# EAGLE schematic ac and dc measurement-old (EAGLE 5.11)
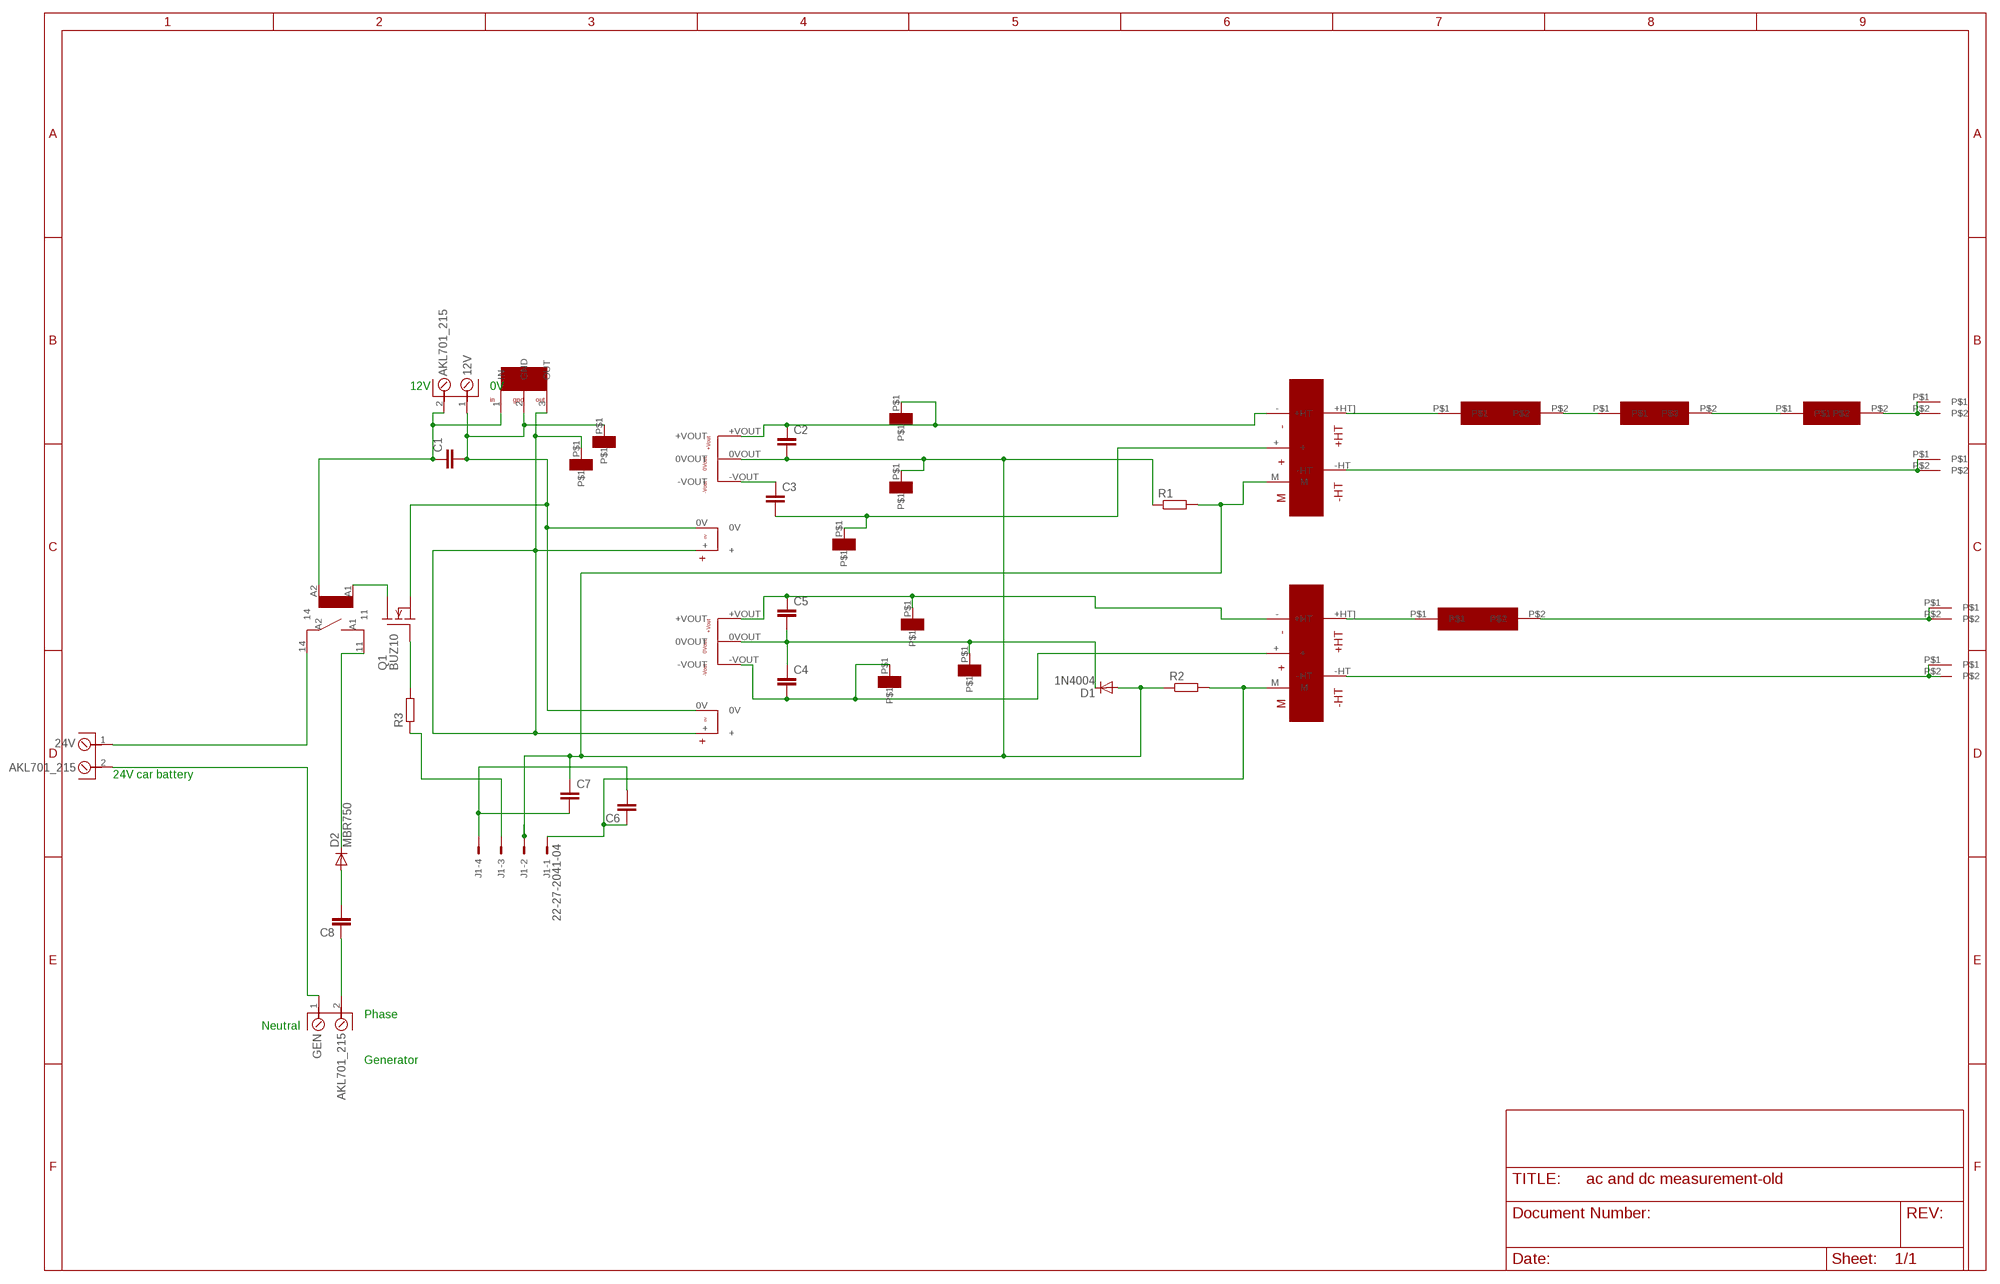
[diagram p0: schematic, sheet 1]

## Parts
5V  KFP_VOL_REG  [TO220]
12V  AKL701_215  [AKL701_2_15]
24V  AKL701_215  [AKL701_2_15]
C1  C-EU025-024X044  [C025-024X044]
C2  C-EU025-024X044  [C025-024X044]
C3  C-EU025-024X044  [C025-024X044]
C4  C-EU025-024X044  [C025-024X044]
C5  C-EU025-024X044  [C025-024X044]
C6  C-EU025-024X044  [C025-024X044]
C7  C-EU025-024X044  [C025-024X044]
C8  C-EU025-030X050  [C025-030X050]
D1  1N4004  [DO41-10]
D2  MBR750  [TO220AC]
GEN  AKL701_215  [AKL701_2_15]
J1  22-27-2041-04  [6410-04]
Q1  BUZ10  [TO220]
R1  R-EU_0204/7  [0204/7]
R2  R-EU_0204/7  [0204/7]
R3  R-EU_0204/7  [0204/7]
U$1  KFP_DC_DC  [KFP_DC-DC]
U$2  KFP_DC_DC  [KFP_DC-DC]
U$3  KFP_VOLTAGETRANSDUCER  [KFP_VOLTAGETRANSDUCER]
U$4  KFP_VOLTAGETRANSDUCER  [KFP_VOLTAGETRANSDUCER]
U$5  KFP_33K  [KFP_33K]
U$6  KFP_33K  [KFP_33K]
U$7  KFP_22K  [KFP_22K]
U$8  KFP_4.7K  [KFP_18K]
U$9  HIGH_AMP_TERMINAL  [HIGH_AMP_TERMINAL]
U$10  KFP_RELAY  [KFP_RELAYSPST]
U$11  HIGH_AMP_TERMINAL  [HIGH_AMP_TERMINAL]
U$12  HIGH_AMP_TERMINAL  [HIGH_AMP_TERMINAL]
U$13  HIGH_AMP_TERMINAL  [HIGH_AMP_TERMINAL]
U$14  KFP_TEST  [KFP_TEST]
U$15  KFP_TEST  [KFP_TEST]
U$16  KFP_TEST  [KFP_TEST]
U$17  KFP_TEST  [KFP_TEST]
U$18  KFP_TEST  [KFP_TEST]
U$19  KFP_TEST  [KFP_TEST]
U$20  KFP_TEST  [KFP_TEST]
U$21  KFP_TEST  [KFP_TEST]

## Nets
N$1: 5V.2(GND) 12V.1 C1.2 Q1.3(S) U$1.0V U$2.0V U$21.P$1
N$2: 5V.3(OUT) U$1.+ U$2.+ U$16.P$1
N$3: C3.2 U$3.+ U$14.P$1
N$4: C4.2 U$2.-VOUT U$4.+ U$18.P$1
N$5: C6.2 C7.2 J1.4
N$6: C2.1 U$1.+VOUT U$3.- U$15.P$1
N$7: C4.1 C5.2 D1.C U$2.0VOUT U$20.P$1
N$8: C5.1 U$2.+VOUT U$4.- U$17.P$1
N$9: 24V.2 GEN.1
N$10 [AC]: U$4.+HT](+HT) U$5.P$1
N$11: C6.1 J1.1 R2.2 U$4.M
N$12 [DC LINK]: U$3.+HT](+HT) U$6.P$1
N$13 [DC LINK]: U$6.P$2 U$7.P$1
N$14: Q1.2(D) U$10.A1
N$15 [AC]: U$5.P$2 U$12.P$1 U$12.P$2
N$16 [AC]: U$4.-HT U$13.P$1 U$13.P$2
N$17: Q1.1(G) R3.2
N$18 [DC LINK]: U$3.-HT U$11.P$1 U$11.P$2
N$19: C8.1 GEN.2
N$20: C8.2 D2.A
N$21: U$8.P$2 U$9.P$1 U$9.P$2
N$22: C2.2 C7.1 D1.A J1.2 R1.1 R1.2 R2.1 U$1.0VOUT U$3.M U$19.P$1
N$23: C3.1 U$1.-VOUT
N$24: J1.3 R3.1
N$25: 5V.1(IN) 12V.2 C1.1 U$10.A2
N$26: D2.C U$10.11
N$27: 24V.1 U$10.14
RESISTOR [DC LINK]: U$7.P$2 U$8.P$1

## Notes on the sheet
- 12V | 0V
- 24V car battery
- Phase
- Neutral
- Generator

## Library data of the parts
5V = kfp_vol_reg:KFP_VOL_REG
12V 24V GEN = _con_riacon_akl701:AKL701_2*: RIACON (Ria Connect) Screw Type Terminal Block Type AKL 701 - 2 (pole-size: 2) centerline 6.35 mm / 0.250 inches, 400 V / 24 A, horizontal wire entry, lift system, modular packages: _13: recommended pcb hole dia. = 1,3 mm _15: pcb hole dia. = 1,5 mm (prototyping) Auhtor: Dipl.-Ing. FH Rainer Bayer, Hochschule Heilbronn (rainer.bayer@hs-heilbronn.de)
C1-C8 = resistor:C-EU: CAPACITOR, European symbol
D1 = diode:1N4004: DIODE general purpose rectifier, 1 A
D2 = diode:MBR750: DIODE barrier rectifier, 7.5 A, 50 V
J1 = con-molex:22-?-04: CONNECTOR wire to board 2.54 mm (.1 inch) pitch header; OC_FARNELL: unknown; OC_NEWARK: unknown
Q1 = transistor-fet:BUZ10: N-Channel Enhancement MOSFET 50V; 20A; 0,080Ohm
R1-R3 = resistor:R-EU_: RESISTOR, European symbol
U$1 U$2 = kfp_ac-dc:KFP_DC_DC
U$3 U$4 = KFP_VOLTAGE TRANSDUCER_1:KFP_VOLTAGETRANSDUCER
U$5 U$6 = kfp_33k_5W:KFP_33K
U$7 = kfp_22k_3W:KFP_22K
U$8 = kfp_4.7k_3W:KFP_4.7K
U$9 U$11-U$13 = rectifier_components:HIGH_AMP_TERMINAL
U$10 = kfp_relaynew:KFP_RELAY
U$14-U$21 = KFP_TEST:KFP_TEST

## Net classes
1 24V path: width 2.413 mm
2 DC LINK: width 0 mm, clearance 3.632 mm
3 AC: width 0.003 mm, clearance 2.362 mm